# EAGLE design N40P107 Breakout (EAGLE 6.4)
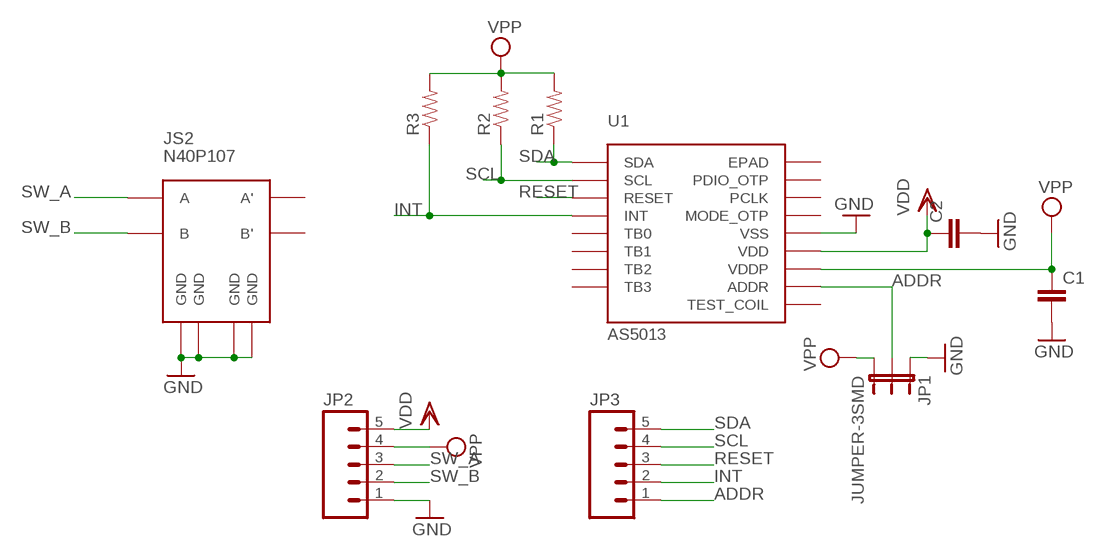
[diagram p0: schematic, sheet 1]

## Parts
C1  CAP0603-CAP  [0603-CAP]
C2  CAP0603-CAP  [0603-CAP]
JP1  JUMPER-3SMD  [SJ_3]
JP2  M05PTH  [1X05]
JP3  M05PTH  [1X05]
JS2  N40P107  [N40P107]
R1  RESISTOR0402-RES  [0402-RES]
R2  RESISTOR0402-RES  [0402-RES]
R3  RESISTOR0402-RES  [0402-RES]
U1  AS5013  [AS5013]

## Nets
ADDR: JP1.2 JP3.1 U1.10(ADDR)
GND: C1.2 C2.2 JP1.1 JP2.1 JS2.1(GND) JS2.4(GND) JS2.5(GND) JS2.8(GND) U1.13(VSS)
INT: JP3.2 R3.1 U1.4(INT)
RESET: JP3.3 U1.3(RESET)
SCL: JP3.4 R2.1 U1.2(SCL)
SDA: JP3.5 R1.1 U1.1(SDA)
SW_A: JP2.3 JS2.2(A)
SW_B: JP2.2 JS2.3(B)
VDD: C2.1 JP2.5 U1.12(VDD)
VPP: C1.1 JP1.3 JP2.4 R1.2 R2.2 R3.2 U1.11(VDDP)
Unconnected: JS2.6(B') JS2.7(A') U1.5(TB0) U1.6(TB1) U1.7(TB2) U1.8(TB3) U1.9(TEST_COIL) U1.14(MODE_OTP) U1.15(PCLK) U1.16(PDIO_OTP) U1.17(EPAD)

## Library data of the parts
C1 C2 = SparkFun-Passives:CAP: Capacitor Standard 0603 ceramic capacitor, and 0.1" leaded capacitor.
JP1 = SparkFun-Passives:JUMPER-3
JP2 JP3 = SparkFun-Connectors:M05: Header 5 Standard 5-pin 0.1" header. Use with straight break away headers (SKU : PRT-00116), right angle break away headers (PRT-00553), swiss pins (PRT-00743), machine pins (PRT-00117), and female headers (PRT-00115). Molex polarized connector foot print use with SKU : PRT-08230 with associated crimp pins and housings.
JS2 = EasyPoint:N40P107
R1-R3 = SparkFun-Passives:RESISTOR: Resistor Basic schematic elements and footprints for 0603, 1206, and PTH resistors.
U1 = EasyPoint:AS5013

## Board
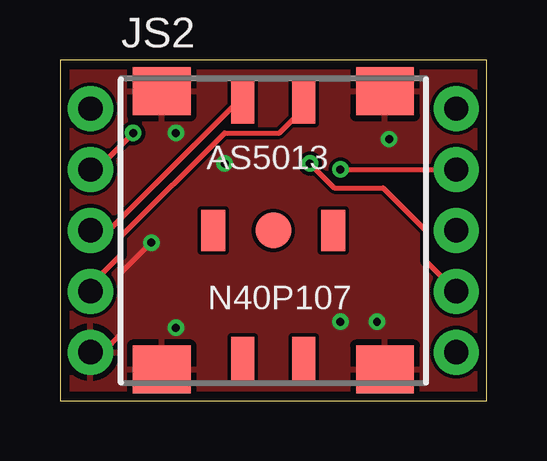
[diagram p1: board, top side]
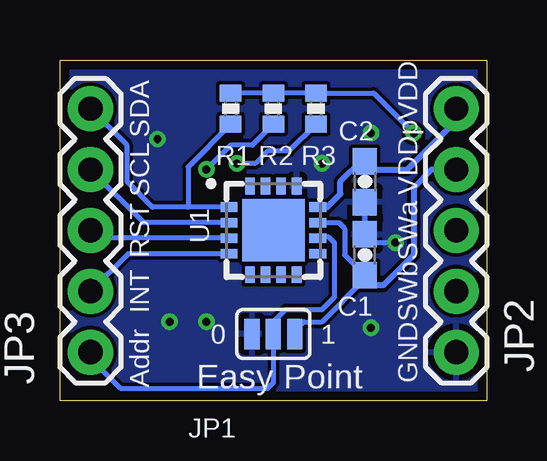
[diagram p2: board, bottom side, seen from below]

Size 17.78 x 14.22 mm. Coordinates in mm from the lower left corner, seen from the top.
Outline: 0,0 17.78,0 17.78,14.22 0,14.22 0,0
Copper layers (1*16): Top 0.0356mm / dielectric 1.5011mm / Bottom 0.0356mm
Design rules "LaenPCBOrder": minimum track width 6mil, minimum drill 13mil, track to track 6mil, track to pad 6mil, pad to pad 6mil, via to via 6mil, smd to smd 6mil, copper to edge 15mil, drill to drill 6mil, minimum pad ring 7mil, minimum via ring 7mil, stop-mask expansion 4mil, vias tented up to drill 13mil, thermal gap 10mil

### Footprints (pad centres in the part's own frame; a part is rotated, then mirrored left to right if it is on the bottom)
0603-CAP = smd 1.1 x 1: 1 -0.85,0; 2 0.85,0
SJ_3 = smd 0.635 x 1.27: 1 -0.889,0; 2 0,0; 3 0.889,0
1X05 = drill 1.016 pad 1.88: 1 0,0; 2 2.54,0; 3 5.08,0; 4 7.62,0; 5 10.16,0
N40P107 = smd 2.4 x 2: 1 -4.65,5.8; 4 4.65,5.8; 5 4.65,-5.8; 8 -4.65,-5.8 | smd 0.95 x 1.8: 2 -1.27,5.35; 3 1.27,5.35; 6 1.27,-5.35; 7 -1.27,-5.35 | smd 1 x 1.7: 9 -2.5,0; 10 2.5,0 | smd 1.5 x 1.5: 11 0,0
0402-RES = smd 0.7 x 0.9: 1 -0.65,0; 2 0.65,0
AS5013 = smd 0.7 x 0.4: 1 -1.85,0.975; 2 -1.85,0.325; 3 -1.85,-0.325; 4 -1.85,-0.975; 9 1.85,-0.975; 10 1.85,-0.325; 11 1.85,0.325; 12 1.85,0.975 | smd 0.4 x 0.7: 5 -0.975,-1.85; 6 -0.325,-1.85; 7 0.325,-1.85; 8 0.975,-1.85; 13 0.975,1.85; 14 0.325,1.85; 15 -0.325,1.85; 16 -0.975,1.85 | smd 2.6 x 2.6: 17 0,0

### Placement (x,y rotation side)
C1  5.08,6.1 90 bottom
C2  5.08,9.14 270 bottom
JP1  8.89,2.79 0 bottom
JP2  1.27,2.03 90 bottom
JP3  16.51,2.03 90 bottom
JS2  8.89,7.11 0 top
R1  10.67,12.19 90 bottom
R2  8.89,12.19 90 bottom
R3  7.11,12.19 90 bottom
U1  8.89,7.11 0 bottom

### Tracks (layer width: path | path; a pad name or v marks a point on that pad's centre or on a via)
ADDR
  Bottom 0.203: JP3.1 16.51,1.78 15.24,0.51 9.14,0.51 8.89,0.76 JP1.2 8.89,3.3 8.38,3.81 6.86,3.81 6.35,4.32 6.35,6.6 6.6,6.86 6.97,6.86 U1.10
GND  (via drill 0.33)
  Top 0.203: v3.81,6.6 2.54,5.33 2.54,2.79 1.78,2.03 JP2.1
  Bottom 0.203: C2.2 C1.2 4.91,6.6 v3.81,6.6
  other vias: 6.86,9.91 4.83,11.18 13.72,10.92 13.21,3.3 11.68,3.3 4.83,3.05
  pour Bottom: 0,0 0,14.22 17.78,14.22 17.78,0
  pour Top: 0,0 0,14.22 17.78,14.22 17.78,0
INT  (via drill 0.33)
  Top 0.203: v10.41,9.91 11.43,8.89 13.46,8.89 15.24,7.11 15.24,5.84 JP3.2
  Bottom 0.203: U1.4 14.95,6.14 JP3.2 | R3.1 8.24,10.41 9.14,10.41 9.65,9.91 v10.41,9.91
RESET
  Bottom 0.203: U1.3 16.18,6.79 JP3.3
SCL  (via drill 0.33)
  Top 0.203: v11.68,9.65 JP3.4
  Bottom 0.203: U1.2 14.29,7.44 JP3.4 | v11.68,9.65 10.67,10.67 9.76,10.67 R2.1
SDA
  Bottom 0.203: U1.1 12.45,8.09 | 12.45,8.09 13.93,8.09 14.99,9.14 14.99,10.67 JP3.5 | R1.1 12.45,9.76 12.45,8.09
SW_A
  Top 0.203: JS2.2 7.38,12.46 2.03,7.11 JP2.3
SW_B
  Top 0.203: JS2.3 10.16,12.19 9.14,11.18 6.86,11.18 2.54,6.86 2.54,6.1 1.27,4.83 JP2.2
VDD
  Bottom 0.203: U1.12 6.64,8.09
  Bottom 0.254: JP2.5 1.27,11.68 3.3,9.65 4.91,9.65 C2.1 5.25,9.99 6.1,9.14 6.1,8.64 6.64,8.09
VPP  (via drill 0.33)
  Top 0.203: v3.05,11.18 1.52,9.65 JP2.4
  Bottom 0.203: U1.11 6.17,7.44 5.92,7.19 5.92,6.08 C1.1 | 4.99,4.83 C1.1 | R1.2 R2.2 R3.2 4.71,12.84 v3.05,11.18 | 5.08,5.59 C1.1 | JP1.3 8,2.92 7.62,3.3 6.86,3.3 5.08,5.08 C1.1
  Bottom 0.254: JP2.4 2.29,9.65 3.05,8.89 3.05,6.1 4.32,4.83 4.99,4.83

### Text on the board
tPlace: AS5013 | N40P107
bPlace: VDD | SDA | VDDp | SCL | SWa | RST | SWb | INT | 1 | 0 | GND | Addr | Easy Point